# EAGLE design mainSchema (EAGLE 7.7.0)
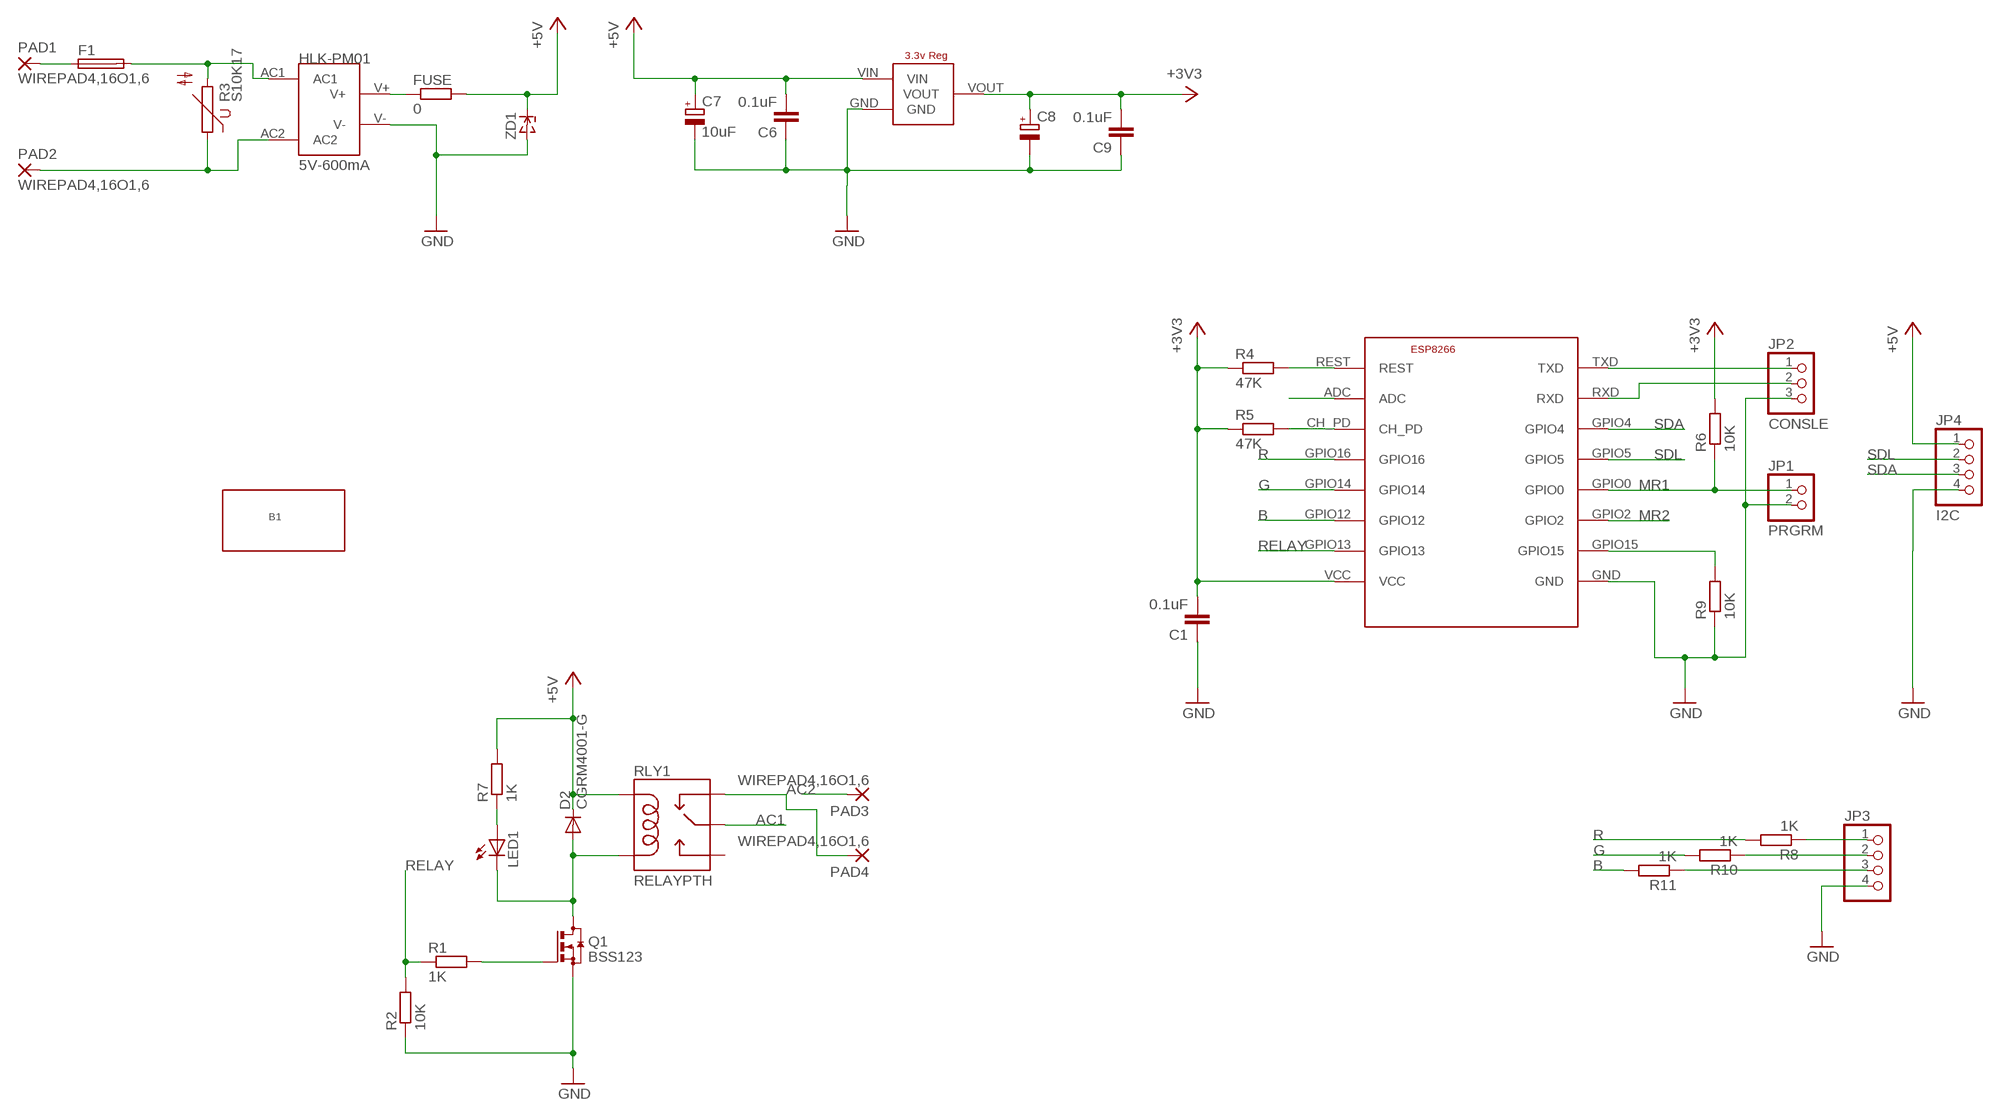
[diagram p0: schematic, sheet 1]

## Parts
B1  VR1_POWER  [VR1-POWER]
C1  0.1uF  C-EUC1206  [C1206]
C6  0.1uF  C-EUC1206  [C1206]
C7  10uF  CPOL-EUA  [PANASONIC_A]
C8  CPOL-EUA  [PANASONIC_A]
C9  0.1uF  C-EUC1206  [C1206]
D2  CGRM4001-G  [SOD-123_MINI-SMA]
ESP8266  ESP8266-07  [ESP-07]
F1  PICOFUSE  [PICOFUSE]
FUSE  0  R-EU_R1206  [R1206]
JP1  PRGRM  PINHD-1X2  [1X02]
JP2  CONSLE  PINHD-1X3  [1X03]
JP3  PINHD-1X4  [1X04]
JP4  I2C  PINHD-1X4  [1X04]
LED1  LEDSMT1206  [1206]
PAD1  WIREPAD4,16O1,6  [4,16O1,6]
PAD2  WIREPAD4,16O1,6  [4,16O1,6]
PAD3  WIREPAD4,16O1,6  [4,16O1,6]
PAD4  WIREPAD4,16O1,6  [4,16O1,6]
Q1  BSS123  [SOT23]
R1  1K  R-EU_R0603  [R0603]
R2  10K  R-EU_R0603  [R0603]
R3  S10K17  [S10K17]
R4  47K  R-EU_R0603  [R0603]
R5  47K  R-EU_R0603  [R0603]
R6  10K  R-EU_R0603  [R0603]
R7  1K  R-EU_R0603  [R0603]
R8  1K  R-EU_R0603  [R0603]
R9  10K  R-EU_R0603  [R0603]
R10  1K  R-EU_R0603  [R0603]
R11  1K  R-EU_R0603  [R0603]
RLY1  RELAYPTH  [SRD-05VDC-SL-C]
U$1  HILINK  [HLK-PM01]
U$5  LD1117  [LD1117SOT-223]
ZD1  ZENERSOD-123  [SOD-123]

## Nets
+3V3: C1.2 C8.+ C9.2 ESP8266.VCC R4.1 R5.1 R6.2 U$5.VOUT
+5V: C6.2 C7.+ D2.C FUSE.2 JP4.1 R7.2 RLY1.COIL1 U$5.VIN ZD1.C
AC1: F1.2 R3.2 RLY1.SWCOMMON U$1.AC1
AC2: PAD2.1(P) PAD3.1(P) R3.1 U$1.AC2
ADC: ESP8266.ADC
B: ESP8266.GPIO12 R11.2
G: ESP8266.GPIO14 R10.2
GND: C1.1 C6.1 C7.- C8.- C9.1 ESP8266.GND JP1.2 JP2.3 JP3.4 JP4.4 Q1.2(S) R2.1 R9.1 U$1.V- U$5.GND ZD1.A
MR1: ESP8266.GPIO0 JP1.1 R6.1
MR2: ESP8266.GPIO2
N$1: PAD4.1(P) RLY1.SWCLOSED(SWCLOSE)
N$2: F1.1 PAD1.1(P)
N$3: ESP8266.CH_PD R5.2
N$4: ESP8266.GPIO15 R9.2
N$5: ESP8266.TXD JP2.1
N$6: ESP8266.RXD JP2.2
N$7: ESP8266.REST R4.2
N$8: FUSE.1 U$1.V+
N$9: Q1.1(G) R1.2
N$10: D2.A LED1.C Q1.3(D) RLY1.COIL0
N$11: JP3.3 R11.1
N$12: JP3.2 R10.1
N$13: LED1.A R7.1
N$14: JP3.1 R8.1
R: ESP8266.GPIO16 R8.2
RELAY: ESP8266.GPIO13 R1.1 R2.2
SDA: ESP8266.GPIO4 JP4.3
SDL: ESP8266.GPIO5 JP4.2
Unconnected: RLY1.SWOPEN

## Library data of the parts
B1 = Cover_box:VR1_POWER: VR1 case from Ambox Sizes http://ambox.com.ua/files/uploads/pdf/id_99_VR1.PDF
C1 C6 C9 = resistor:C-EU: CAPACITOR, European symbol
C7 C8 = resistor:CPOL-EU: POLARIZED CAPACITOR, European symbol
D2 = diode:CGRM400*-G: Molded plasitc,JEDEC SOD-123/Mini SMA Source: Comchip CGRM4001-G.pdf
ESP8266 = lio:ESP8266
F1 = fuse:PICOFUSE: PICOFUSE 19275, Wickmann; OC_FARNELL: unknown; OC_NEWARK: unknown
FUSE R1 R2 R4-R11 = resistor:R-EU_: RESISTOR, European symbol
JP1 = pinhead:PINHD-1X2: PIN HEADER
JP2 = pinhead:PINHD-1X3: PIN HEADER
JP3 JP4 = pinhead:PINHD-1X4: PIN HEADER
LED1 = adafruit:LED: LED OSRAM: - CHIPLED LG R971, LG N971, LY N971, LG Q971, LY Q971, LO R971, LY R971 LH N974, LH R974 LS Q976, LO Q976, LY Q976 LO Q996 - Hyper CHIPLED LW Q18S LB Q993, LB Q99A, LB R99A - SideLED LS A670, LO A670, LY A670, LG A670, LP A670 LB A673, LV A673, LT A673, LW A673 LH A674 LY A675 LS A676, LA A676, LO A676, LY A676, LW A676 LS A679, LY A679, LG A679 - Hyper Micro SIDELED® LS Y876, LA Y876, LO Y876, LY Y876 LT Y87S - SmartLED LW L88C, LW L88S LB L89C, LB L89S, LG L890 LS L89K, LO L89K, LY L89K LS L896, LA L896, LO L896, LY L896 - TOPLED LS T670, LO T670, LY T670, LG T670, LP T670 LSG T670, LSP T670, LSY T670, LOP T670, LYG T670 LG T671, LOG T671, LSG T671 LB T673, LV T673, LT T673, LW T673 LH T674 LS T676, LA T676, LO T676, LY T676, LB T676, LH T676, LSB T676, LW T676 LB T67C, LV T67C, LT T67C, LS T67K, LO T67K, LY T67K, LW E67C LS E67B, LA E67B, LO E67B, LY E67B, LB E67C, LV E67C, LT E67C LW T67C LS T679, LY T679, LG T679 LS T770, LO T770, LY T770, LG T770, LP T770 LB T773, LV T773, LT T773, LW T773 LH T774 LS E675, LA E675, LY E675, LS T675 LS T776, LA T776, LO T776, LY T776, LB T776 LHGB T686 LT T68C, LB T68C - Hyper Mini TOPLED® LB M676 - Mini TOPLED Santana® LG M470 LS M47K, LO M47K, LY M47K Source: http://www.osram.convergy.de/
PAD1-PAD4 = wirepad:WIREPAD: Wire PAD connect wire on PCB
Q1 = transistor-small-signal:BSS123: N-CHANNEL MOS FET
R3 = varistor:S10K17: VARISTOR
RLY1 = SRD-05VDC-SL-C:RELAY: SPDT relay (COM-00101)
U$1 = davLib:HILINK
U$5 = LD1117:LD1117
ZD1 = dp_devices:ZENER: Zener Diode SOD-323

## Board
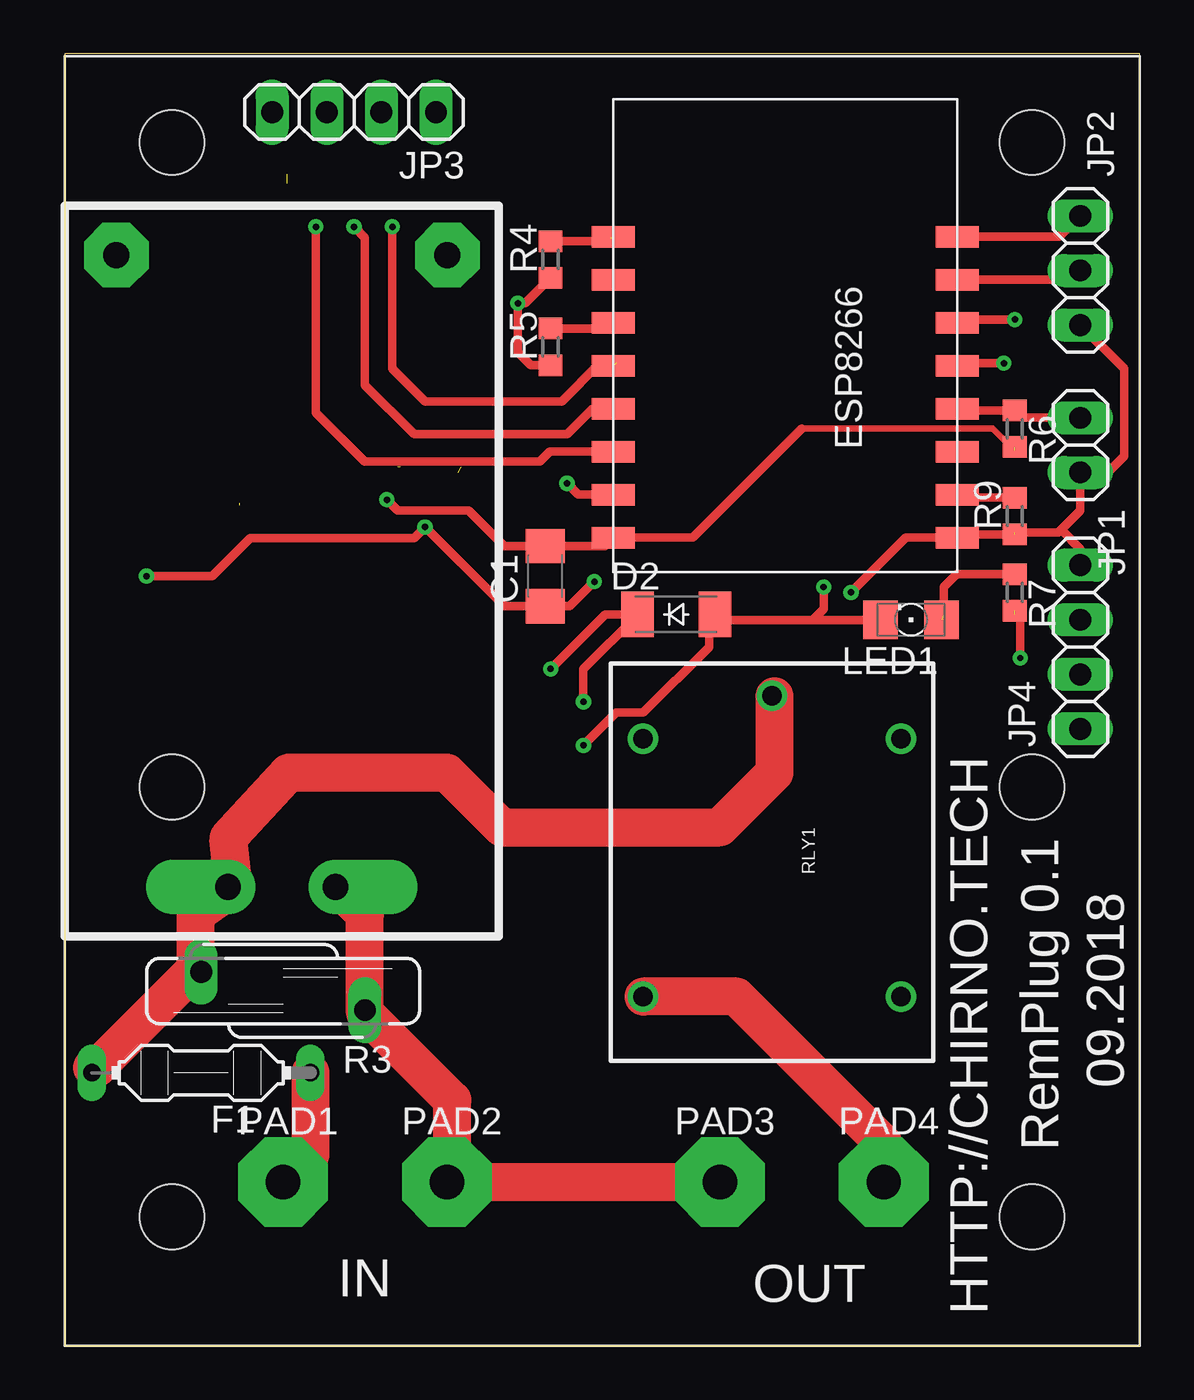
[diagram p1: board, top side]
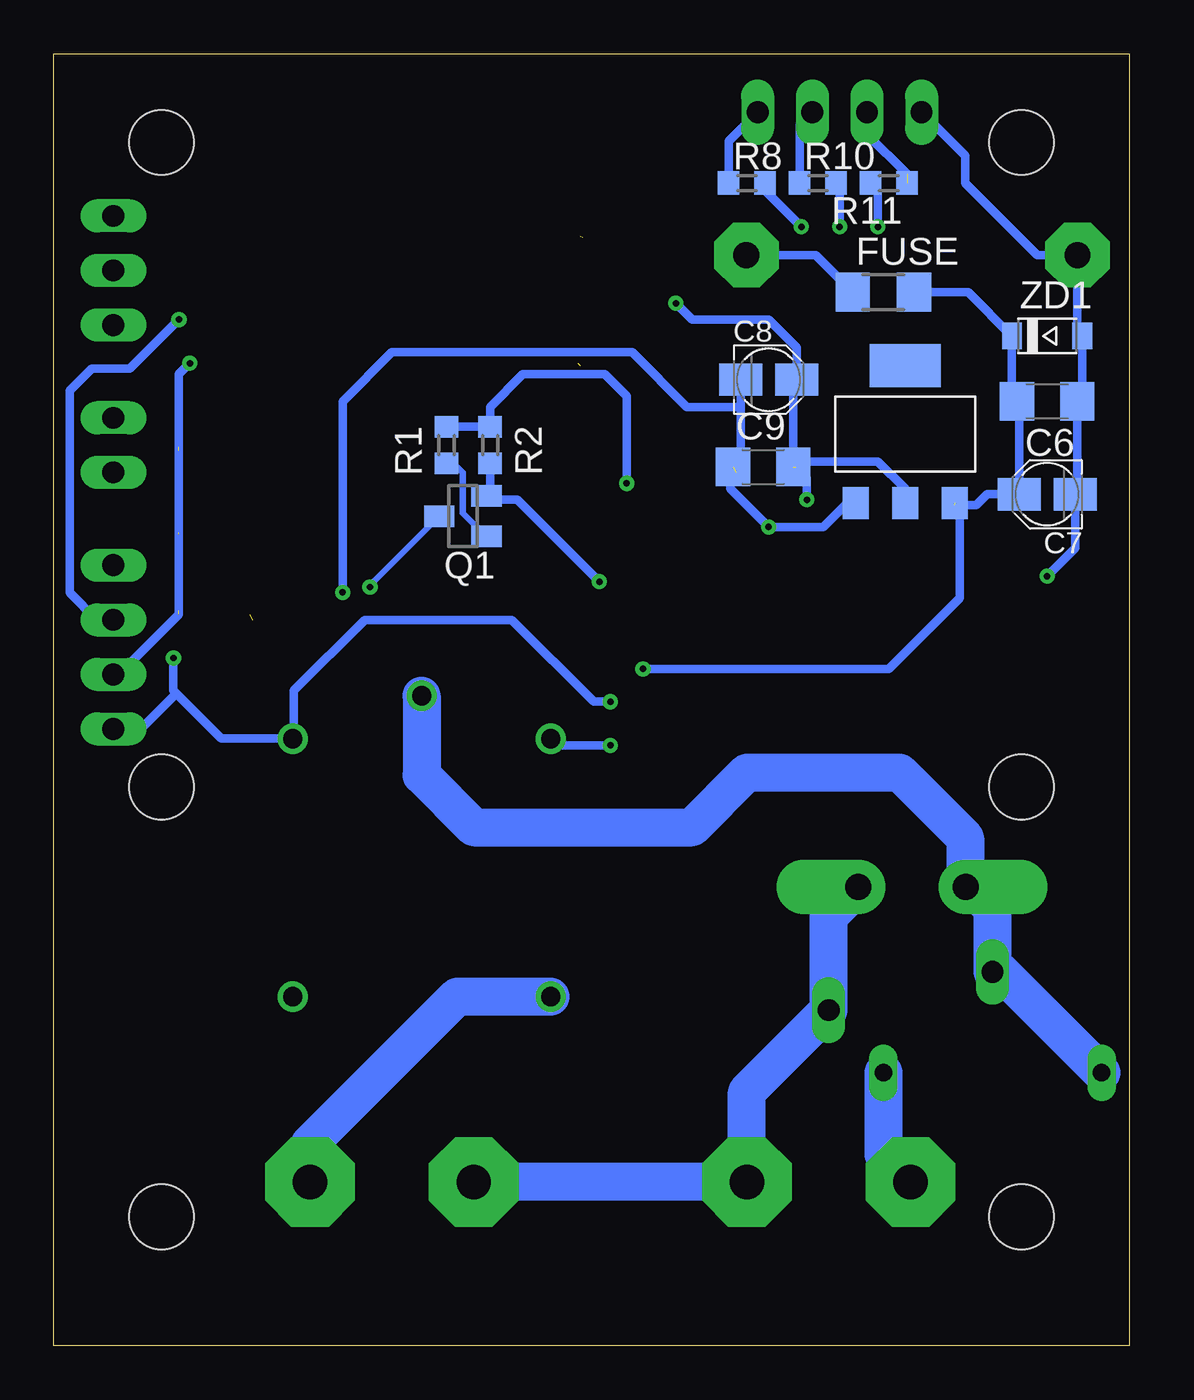
[diagram p2: board, bottom side, seen from below]

Size 50.02 x 60.12 mm. Coordinates in mm from the lower left corner, seen from the top.
Outline: 0,0 50.02,0 50.02,60.12 0,60.12 0,0
Copper layers (1*16): Top 0.035mm / dielectric 1.5mm / Bottom 0.035mm
Design rules "default *": minimum track width 10mil, minimum drill 0.3mm, track to track 0.167640625mm, track to pad 0.167640625mm, pad to pad 0.167640625mm, via to via 0.167640625mm, smd to smd 0.167640625mm, copper to edge 30mil, drill to drill 8mil, minimum pad ring 10mil, minimum via ring 8mil, stop-mask expansion 4mil, vias tented up to drill 0.4mm, thermal gap 10mil

### Footprints (pad centres in the part's own frame; a part is rotated, then mirrored left to right if it is on the bottom)
VR1-POWER = hole 3: 45,56; 5,56; 5,26; 45,26; 45,6; 5,6
C1206 = smd 1.6 x 1.8: 1 -1.4,0; 2 1.4,0
PANASONIC_A = smd 2 x 1.5: + 1.3,0; - -1.3,0
SOD-123_MINI-SMA = smd 1.5 x 2.1: A 1.8,0; C -1.8,0
ESP-07 = smd 1 x 2: ADC -1.6,-8; CH_PD 0.4,-8; GND 10.4,8; GPIO0 4.4,8; GPIO2 6.4,8; GPIO4 0.4,8; GPIO5 2.4,8; GPIO12 6.4,-8; GPIO13 8.4,-8; GPIO14 4.4,-8; GPIO15 8.4,8; GPIO16 2.4,-8; REST -3.6,-8; RXD -1.6,8; TXD -3.6,8; VCC 10.4,-8
PICOFUSE = drill 0.813 long: 1 -5.08,0; 2 5.08,0
R1206 = smd 1.6 x 1.803: 1 -1.422,0; 2 1.422,0
1X02 = drill 1.016 long: 1 -1.27,0; 2 1.27,0
1X03 = drill 1.016 long: 1 -2.54,0; 2 0,0; 3 2.54,0
1X04 = drill 1.016 long: 1 -3.81,0; 2 -1.27,0; 3 1.27,0; 4 3.81,0
1206 = smd 1.6 x 1.803: A -1.422,0; C 1.422,0
4,16O1,6 = drill 1.6 pad 4.166 octagon: 1 0,0
SOT23 = smd 1 x 1.4: 1 -0.95,-1.1; 2 0.95,-1.1; 3 0,1.1
R0603 = smd 1 x 1.1: 1 -0.85,0; 2 0.85,0
S10K17 = drill 1.016 long: 1 -0.889,-3.81; 2 0.889,3.81
SRD-05VDC-SL-C = drill 0.9: COIL0 -5.39,-6.12; COIL1 -5.39,5.88; SWCLOSED 6.61,-6.12; SWCOMMON -7.39,-0.12; SWOPEN 6.61,5.88
HLK-PM01 = drill 1.2 pad 2.54 offset: AC1 7.6,2.3; AC2 12.6,2.3 | drill 1.2 pad 3 octagon: V+ 17.8,31.7; V- 2.4,31.7
LD1117SOT-223 = smd 3.3 x 2: (VOUT) 0,3.2 | smd 1.2 x 1.5: GND -2.3,-3.2; VIN 2.3,-3.2; VOUT 0,-3.2
SOD-123 = smd 0.91 x 1.22: A 1.635,0; C -1.635,0

### Placement (x,y rotation side)
B1  0,0 0 top
C1  22.35,35.81 90 top
C6  3.81,43.94 180 bottom
C7  3.81,39.62 180 bottom
C8  16.76,44.96 0 bottom
C9  17.02,40.89 0 bottom
D2  28.45,34.04 0 top
ESP8266  33.53,48.01 270 top
F1  6.35,12.7 180 top
FUSE  11.43,49.02 0 bottom
JP1  47.24,41.91 270 top
JP2  47.24,50.04 270 top
JP3  13.46,57.4 180 top
JP4  47.24,32.51 90 top
LED1  39.37,33.78 180 top
PAD1  10.16,7.62 0 top
PAD2  17.78,7.62 0 top
PAD3  30.48,7.62 0 top
PAD4  38.1,7.62 0 top
Q1  30.99,38.61 90 bottom
R1  31.75,41.91 270 bottom
R2  29.72,41.91 90 bottom
R3  10.16,16.51 90 top
R4  22.61,50.55 90 top
R5  22.61,46.48 90 top
R6  44.2,42.67 270 top
R7  44.2,35.05 270 top
R8  17.78,54.1 0 bottom
R9  44.2,38.61 90 top
R10  14.48,54.1 0 bottom
R11  11.18,54.1 180 bottom
RLY1  33.02,22.86 270 top
U$1  0,19.05 0 top
U$5  10.41,42.42 0 bottom
ZD1  3.81,46.99 0 bottom

### Tracks (layer width: path | path; a pad name or v marks a point on that pad's centre or on a via)
+3V3  (via drill 0.3)  (2 unrouted)
  Top 0.305: 34.29,42.67 43.18,42.67 44.2,41.66
  Top 0.406: R4.1 21.42,48.51 v21.08,48.51 21.08,46.23 21.68,45.63 R5.1 22.35,45.38 | 34.29,42.67 29.22,37.61 ESP8266.VCC 25.14,37.21 C1.2 20.44,37.21 18.8,38.86 15.49,38.86 v14.99,39.37
  Bottom 0.406: U$5.VOUT 10.41,39.88 11.68,41.15 15.36,41.15 C9.2 15.62,44.8 C8.+ 15.46,46.45 16.76,47.75 20.32,47.75 v21.08,48.51 | v14.99,39.37 14.99,40.39 15.49,40.89
+5V  (via drill 0.3)  (2 unrouted)
  Top 0.406: v22.61,31.5 25.15,34.04 D2.C 26.65,34.01 24.13,31.5 v24.13,29.97 | v44.45,32 44.45,33.78 44.2,34.04
  Bottom 0.406: FUSE.2 7.48,49.02 ZD1.C 5.45,44.18 C6.2 5.11,43.84 C7.+ 6.6,39.62 7.11,39.12 8.01,39.12 U$5.VIN | v22.61,31.5 11.18,31.5 7.87,34.8 7.87,38.86 8.13,39.12 | v24.13,29.97 24.89,29.97 28.7,33.78 35.56,33.78 38.86,30.48 38.86,28.29 RLY1.COIL1 42.22,28.25 44.32,30.35 | 44.32,30.35 44.45,30.48 v44.45,32 | JP4.1 45.97,28.7 44.32,30.35
AC1
  Bottom 1.778: RLY1.SWCOMMON 32.9,26.55 30.48,24.13 20.32,24.13 17.78,26.67 10.67,26.67 7.62,23.62 7.62,21.59 | 7.62,21.59 7.62,21.37 U$1.AC1 | 7.62,21.59 6.35,20.32 R3.2 5.97,17.4 F1.2
AC2
  Top 1.778: PAD2.1 PAD3.1
  Bottom 1.778: PAD3.1 PAD2.1 17.78,11.81 R3.1 13.97,19.98 U$1.AC2
B  (via drill 0.3)
  Top 0.406: ESP8266.GPIO12 22.56,41.61 22.1,41.15 13.97,41.15 11.68,43.43 v11.68,52.07
  Bottom 0.406: v11.68,52.07 11.68,53.76 R11.2
G  (via drill 0.3)
  Top 0.406: ESP8266.GPIO14 24.56,43.61 23.37,42.42 16.26,42.42 13.97,44.7 13.97,51.56 v13.46,52.07
  Bottom 0.406: v13.46,52.07 13.46,53.94 R10.2
GND  (via drill 0.3)  (2 unrouted)
  Top 0.406: R9.1 41.68,37.76 ESP8266.GND 39.13,37.61 v36.58,35.05 | v24.64,35.56 23.49,34.41 C1.1 20.45,34.41 v16.76,38.1 16.26,37.59 8.64,37.59 6.86,35.81 v3.81,35.81 | JP2.3 49.28,45.47 49.28,41.4 48.51,40.64 JP1.2 47.24,38.86 46.35,37.97 | 46.35,37.97 46.23,37.85 44.2,37.85 | JP4.4 47.24,37.08 46.35,37.97
  Bottom 0.406: v24.64,35.56 28.45,39.37 29.7,39.37 Q1.2 29.72,39.73 R2.1 | v3.81,35.81 2.51,37.11 C7.- 2.41,39.72 C6.1 2.17,44.18 ZD1.A 2.4,47.22 U$1.V- 4.27,50.75 7.62,54.1 7.62,55.37 JP3.4 | C9.1 18.54,40.77 18.54,39.88 v16.76,38.1 14.22,38.1 13.11,39.22 U$5.GND | C8.- 18.06,43.69 | 18.06,43.69 18.06,40.86 18.29,40.64 | v36.58,35.05 36.58,43.94 34.29,46.23 23.11,46.23 20.57,43.69 18.06,43.69
MR1
  Top 0.406: JP1.1 44.54,43.18 R6.1 42.33,43.52 42.16,43.69 41.61,43.69 ESP8266.GPIO0
N$1
  Top 1.778: PAD4.1 38.1,9.4 31.24,16.26 26.92,16.26
  Bottom 1.778: PAD4.1 38.1,9.4 31.24,16.26 RLY1.SWCLOSED
N$2
  Top 1.778: F1.1 11.43,8.89 PAD1.1
  Bottom 1.778: F1.1 11.43,8.89 PAD1.1
N$3
  Top 0.406: R5.2 25.25,47.33 ESP8266.CH_PD
N$4
  Top 0.406: R9.2 41.68,39.46 ESP8266.GPIO15
N$5
  Top 0.406: ESP8266.TXD 46.27,51.61 JP2.1
N$6
  Top 0.406: ESP8266.RXD 46.81,49.61 JP2.2
N$7  (1 unrouted)
  Top 0.406: R4.2 25.23,51.4 25.4,51.56
N$8
  Bottom 0.406: U$1.V+ 14.58,50.75 FUSE.1
N$9
  Bottom 0.305: Q1.1 30.99,38.76 30.99,40.64 31.41,41.06 R1.2
N$10  (via drill 0.3)
  Top 0.406: 26.92,28.27 RLY1.COIL0 | LED1.C 34.8,33.78 | 34.8,33.78 30.5,33.78 D2.A 29.97,33.76 29.97,32.51 26.92,29.46 25.65,29.46 v24.13,27.94 | v35.31,35.31 35.31,34.29 34.8,33.78
  Bottom 0.305: Q1.3 35.31,35.39 v35.31,35.31
  Bottom 0.406: v24.13,27.94 26.59,27.94 RLY1.COIL0
N$11  (1 unrouted)
  Bottom 0.406: 10.33,54.52 12.19,56.39 JP3.3
N$12
  Bottom 0.406: R10.1 15.33,56.81 JP3.2
N$13  (1 unrouted)
  Top 0.406: R7.1 41.49,35.9 40.89,35.31 40.89,34.04 41.15,33.78
N$14
  Bottom 0.406: R8.1 18.63,56.05 JP3.1
N$15
  Top 1.778: 18.03,7.87 18.03,11.43 13.97,15.49 13.97,20.07 12.7,21.34
N$16
  Top 1.778: 1.27,12.95 1.52,12.95 6.1,17.53 6.1,20.07 7.87,21.34 7.62,23.62 10.41,26.67 17.78,26.67 20.32,24.13 30.48,24.13 33.02,26.67 33.02,30.23
R  (via drill 0.3)  (1 unrouted)
  Top 0.406: v15.24,52.07 15.24,45.47 16.76,43.94 23.11,43.94 24.89,45.72 25.65,45.72
  Bottom 0.406: R8.2 16.93,53.76 v15.24,52.07
RELAY  (via drill 0.3)
  Top 0.406: ESP8266.GPIO13 23.89,39.61 v23.37,40.13
  Bottom 0.406: v23.37,40.13 23.37,44.2 24.38,45.21 28.19,45.21 29.72,43.69 R2.2 R1.1
SDA  (via drill 0.3)
  Top 0.406: v44.2,47.75 41.67,47.75 ESP8266.GPIO4
  Bottom 0.406: JP4.3 48.01,33.78 49.28,35.05 49.28,44.45 48.26,45.47 46.48,45.47 v44.2,47.75
SDL  (via drill 0.3)
  Top 0.406: v43.69,45.72 41.64,45.72 ESP8266.GPIO5
  Bottom 0.406: JP4.2 46.99,31.24 44.2,34.04 44.2,45.21 v43.69,45.72

### Text on the board
tNames: HTTP://CHIRNO.TECH | RemPlug 0.1 | 09.2018 | IN | OUT